# EAGLE design Remote (EAGLE 9.3.2)
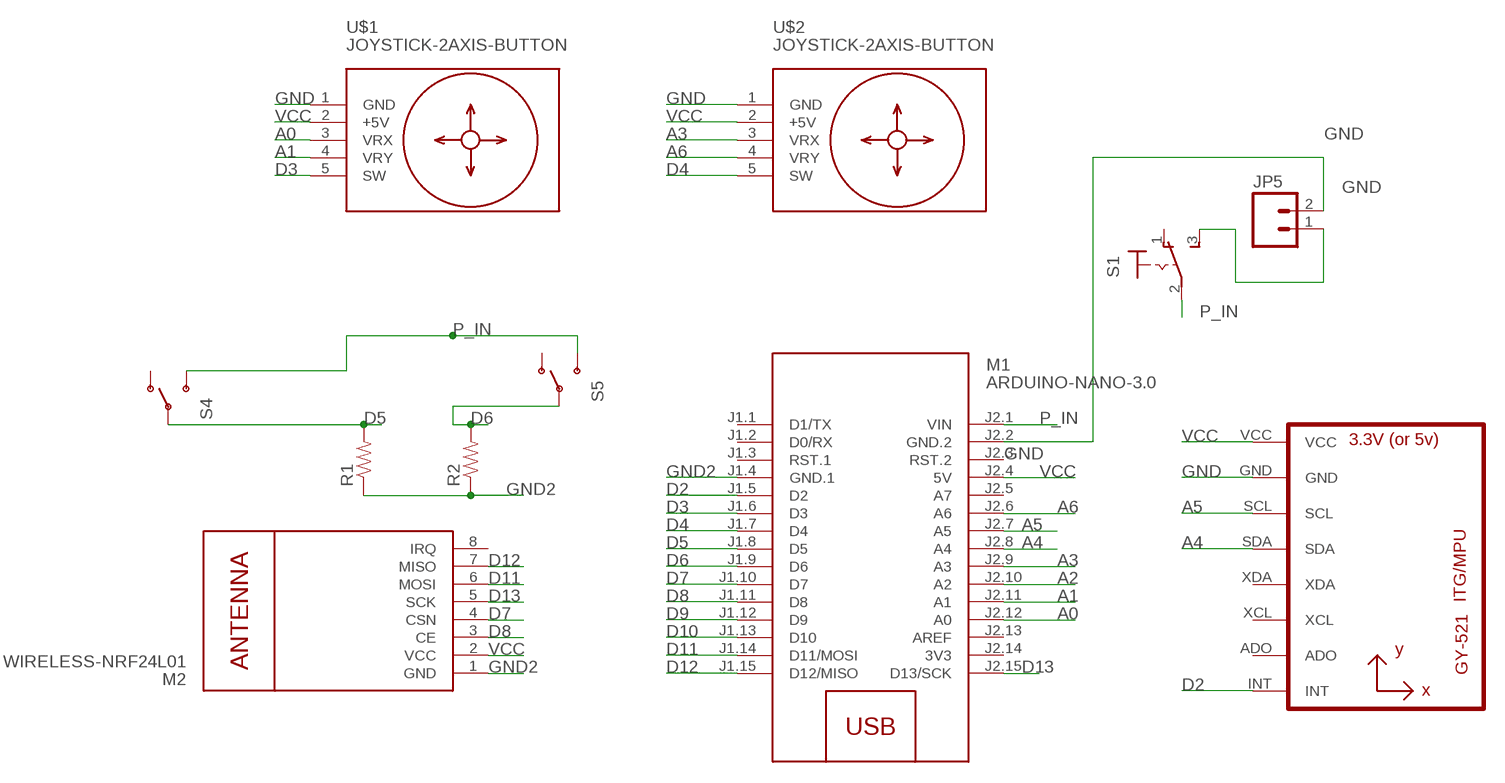
[diagram p0: schematic, sheet 1]

## Parts
JP5  M02PTH  [1X02]
M1  ARDUINO-NANO-3.0  [ARDUINO-NANO-3.0]
M2  WIRELESS-NRF24L01  [WIRELESS-NRF24L01]
R1  RESISTORAXIAL-0.3  [AXIAL-0.3]
R2  RESISTORAXIAL-0.3  [AXIAL-0.3]
S1  M9040P  [M9040P]
S4  SWITCH-SPSTPTH  [SWITCH-SPDT]
S5  SWITCH-SPSTPTH  [SWITCH-SPDT]
U1  GY-521MPU6050  [GY-521]
U$1  JOYSTICK-2AXIS-BUTTON  [JOYSTICK-2AXIS-BUTTON]
U$2  JOYSTICK-2AXIS-BUTTON  [JOYSTICK-2AXIS-BUTTON]

## Nets
A0: M1.J2.12(A0) U$1.3(VRX)
A1: M1.J2.11(A1) U$1.4(VRY)
A2: M1.J2.10(A2)
A3: M1.J2.9(A3) U$2.3(VRX)
A4: M1.J2.8(A4) U1.SDA
A5: M1.J2.7(A5) U1.SCL
A6: M1.J2.6(A6) U$2.4(VRY)
D2: M1.J1.5(D2) U1.INT
D3: M1.J1.6(D3) U$1.5(SW)
D4: M1.J1.7(D4) U$2.5(SW)
D5: M1.J1.8(D5) R1.P$2 S4.2(P)
D6: M1.J1.9(D6) R2.P$2 S5.2(P)
D7: M1.J1.10(D7) M2.4(CSN)
D8: M1.J1.11(D8) M2.3(CE)
D9: M1.J1.12(D9)
D10: M1.J1.13(D10)
D11: M1.J1.14(D11/MOSI) M2.6(MOSI)
D12: M1.J1.15(D12/MISO) M2.7(MISO)
D13: M1.J2.15(D13/SCK) M2.5(SCK)
GND: JP5.2 M1.J2.2(GND.2) U1.GND U$1.1(GND) U$2.1(GND)
GND2: M1.J1.4(GND.1) M2.1(GND) R1.P$1 R2.P$1
N$2: JP5.1 S1.3(S)
P_IN: M1.J2.1(VIN) S1.2(P) S4.3(S) S5.3(S)
VCC: M1.J2.4(5V) M2.2(VCC) U1.VCC U$1.2(+5V) U$2.2(+5V)
Unconnected: M1.J1.1(D1/TX) M1.J1.2(D0/RX) M1.J1.3(RST.1) M1.J2.3(RST.2) M1.J2.5(A7) M1.J2.13(AREF) M2.8(IRQ) S1.1(O) S4.1(O) S5.1(O) U1.ADO U1.XCL U1.XDA

## Power pins joined to a net without a drawn wire
3V3: M1.J2.14(3V3)

## Library data of the parts
JP5 = SparkFun:M02: Header 2 Standard 2-pin 0.1" header. Use with straight break away headers (SKU : PRT-00116), right angle break away headers (PRT-00553), swiss pins (PRT-00743), machine pins (PRT-00117), and female headers (PRT-00115). Molex polarized connector foot print use with SKU : PRT-08233 with associated crimp pins and housings.
M1 = diy-modules:ARDUINO-NANO-3.0: Arduino Nano 3.0 and compatible devices More details available here: https://www.arduino.cc/en/Main/ArduinoBoardNano Click here to find device on ebay.com <http://www.ebay.com/sch/arduino+nano>
M2 = diy-modules:WIRELESS-NRF24L01: 2.4 GHz Wireless Module based on NRF24L01 chip More details available here: http://www.electrodragon.com/w/NRF24L01 Click here to find device on ebay.com <http://www.ebay.com/sch/nrf24l01+arduino>
R1 R2 = SparkFun:RESISTOR: Resistor Basic schematic elements and footprints for 0603, 1206, and PTH resistors.
S1 = switch:M9040P: TOGGLE SWITCH Marquardt
S4 S5 = SparkFun:SWITCH-SPST: SPST Switch Simple slide switch. Spark Fun Electronics SKU : COM-00102
U1 = gy-521:GY-521
U$1 U$2 = diy-modules:JOYSTICK-2AXIS-BUTTON: 2-Axis Analog Joystick with Push Button Tutorial is available here: http://henrysbench.capnfatz.com/henrys-bench/arduino-sensors-and-input/arduino-ps2-joystick-tutorial-keyes-ky-023-deek-robot/ Click here to find device on ebay.com <http://www.ebay.com/sch/joystick+ps2+module>

## Board
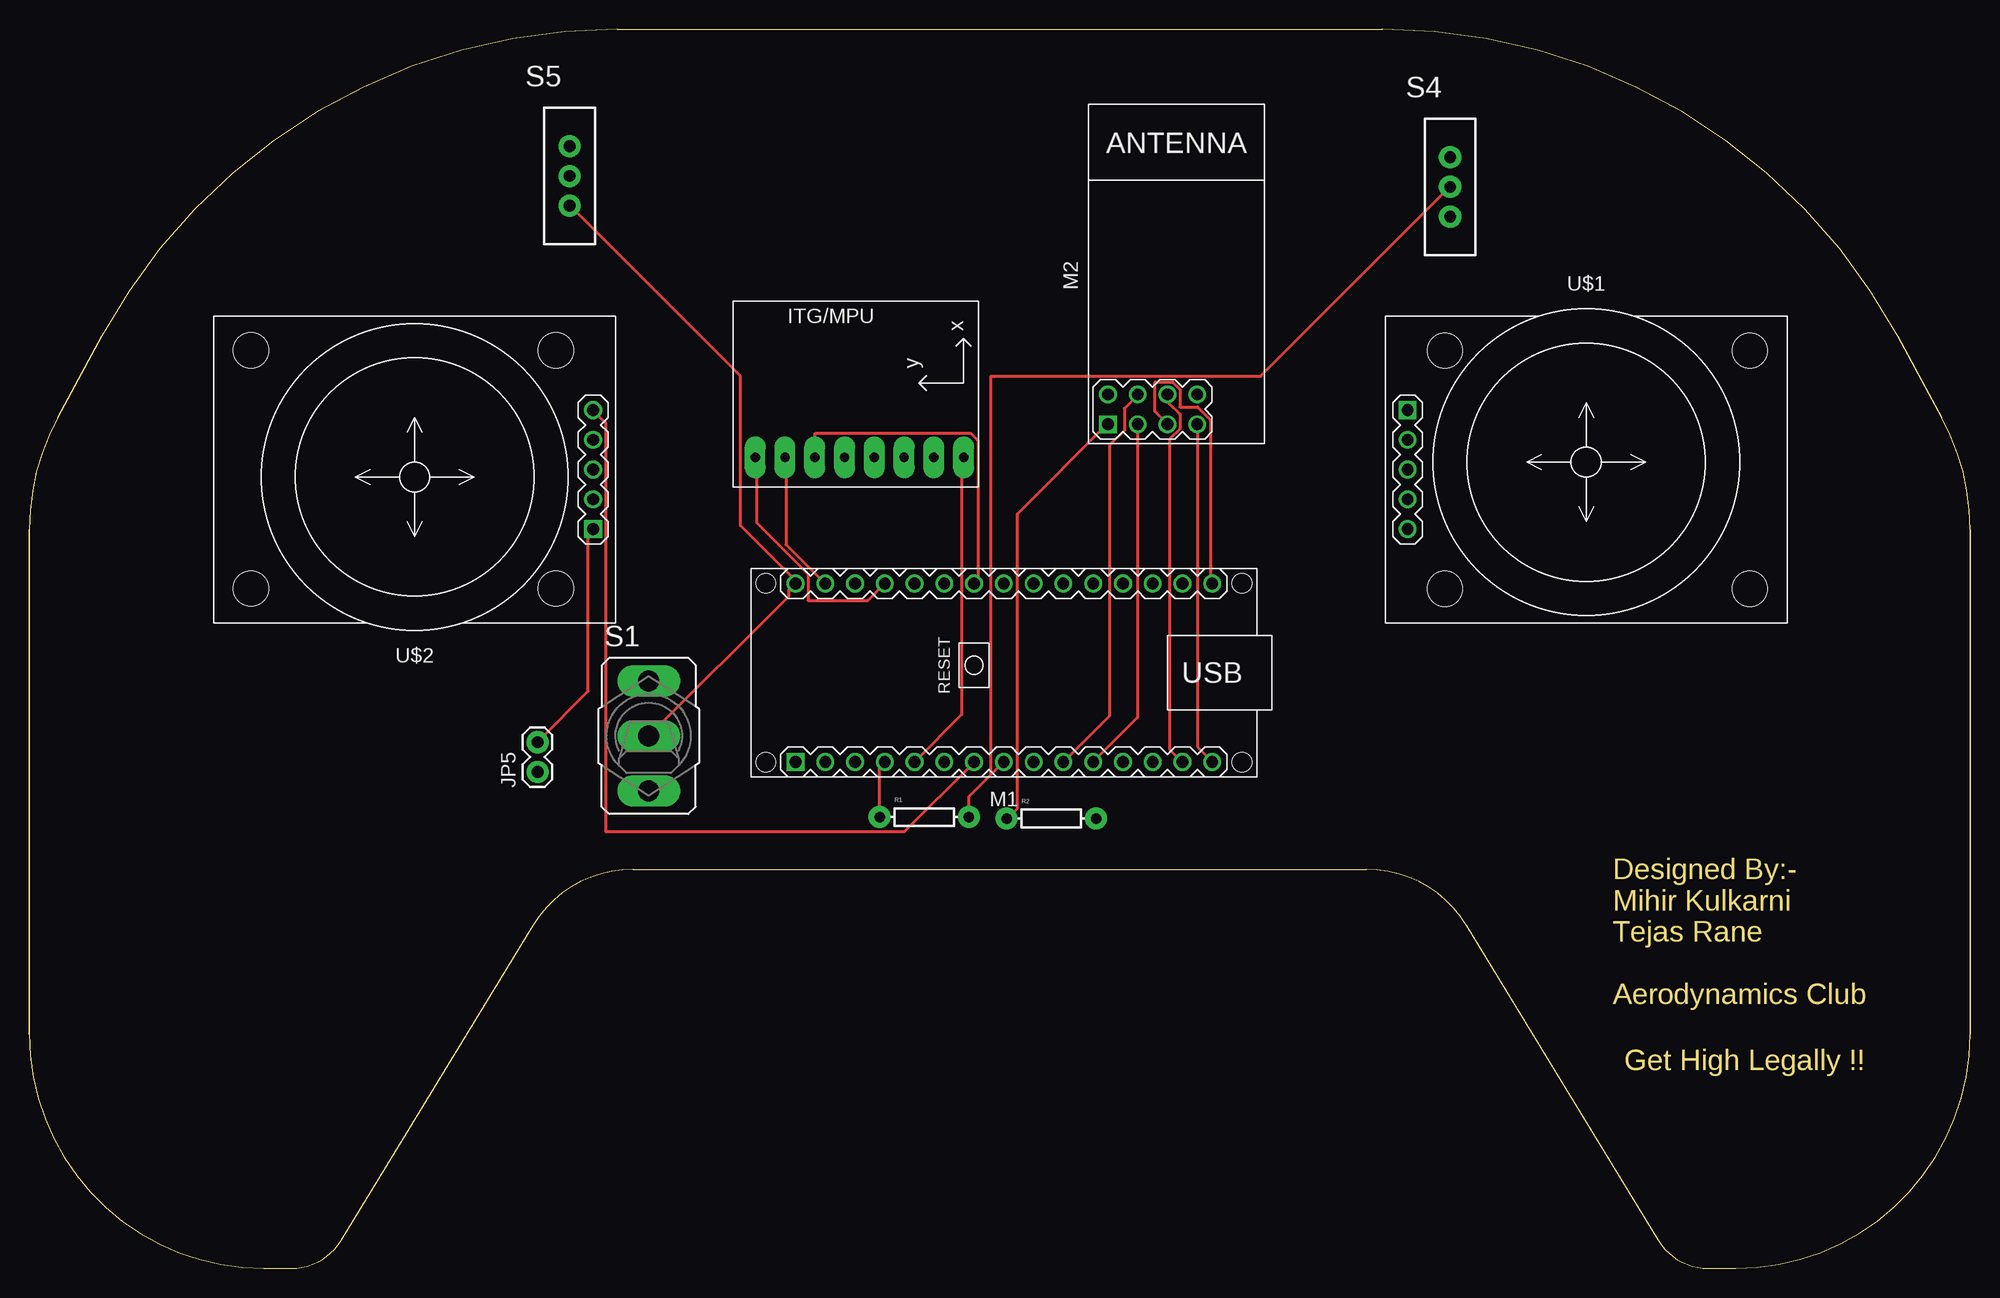
[diagram p1: board, top side]
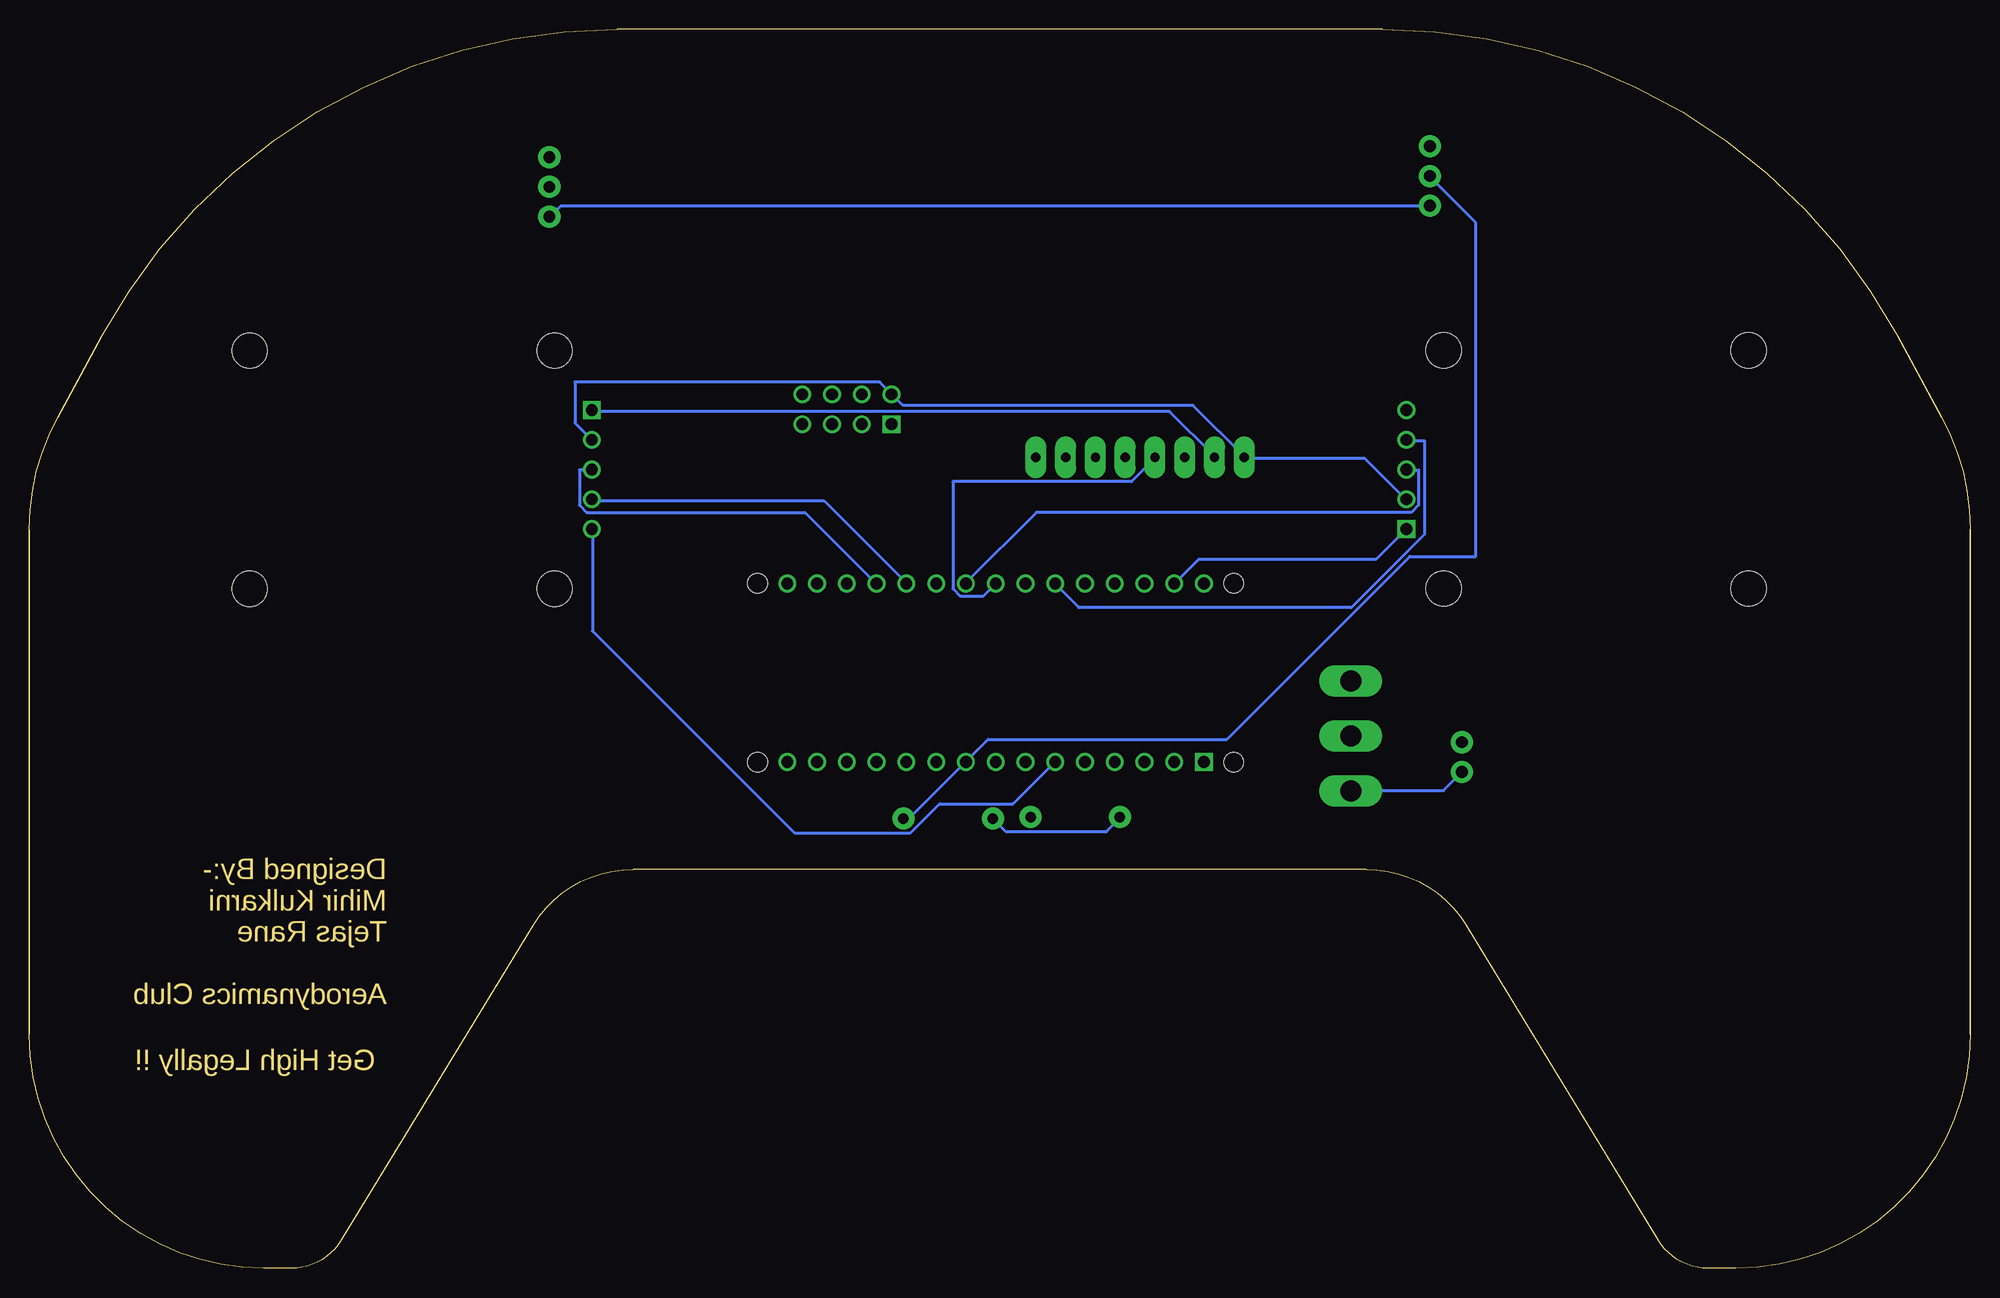
[diagram p2: board, bottom side, seen from below]

Size 165.65 x 105.77 mm. Coordinates in mm from the lower left corner, seen from the top.
Outline: 6.2,79.6 arc-62 50.16,105.77 115.49,105.77 arc-62 159.45,79.6
Outline: 0,20 arc90 20,0 22.34,0 arc59 26.61,2.4
Outline: 165.65,20 arc-90 145.65,0 143.31,0 arc-59 139.04,2.4
Outline: 165.65,63.09 arc28 163.23,72.62
Outline: 2.42,72.62 arc28 0,63.09
Outline: 122.64,29.29 arc59 114.1,34.08 51.55,34.08 arc59 43.01,29.29
Outline: 159.45,79.6 161.57,75.69 163.23,72.62
Outline: 163.23,72.62 159.45,79.6
Outline: 165.65,63.09 165.65,38.96 165.65,20
Outline: 165.65,20 165.65,63.09
Outline: 122.64,29.29 131.82,14.23 139.04,2.4
Outline: 139.04,2.4 122.64,29.29
Outline: 43.01,29.29 33.83,14.23 26.61,2.4
Outline: 26.61,2.4 43.01,29.29
Outline: 0,63.09 0,38.96 0,20
Outline: 0,20 0,63.09
Outline: 2.42,72.62 4.54,76.53 6.2,79.6
Outline: 6.2,79.6 2.42,72.62
Copper layers (1*16): Top 0.035mm / dielectric 1.5mm / Bottom 0.035mm
Design rules "default *": minimum track width 10mil, minimum drill 0.35mm, track to track 6mil, track to pad 6mil, pad to pad 6mil, via to via 6mil, smd to smd 6mil, copper to edge 40mil, drill to drill 6mil, minimum pad ring 10mil, minimum via ring 8mil, stop-mask expansion 4mil, vias tented up to drill 0mil, thermal gap 10mil

### Footprints (pad centres in the part's own frame; a part is rotated, then mirrored left to right if it is on the bottom)
1X02 = drill 1.016 pad 1.88: 1 0,0; 2 2.54,0
ARDUINO-NANO-3.0 = drill 1 square: J1.1 17.78,7.62 | drill 1: J1.2 15.24,7.62; J1.3 12.7,7.62; J1.4 10.16,7.62; J1.5 7.62,7.62; J1.6 5.08,7.62; J1.7 2.54,7.62; J1.8 0,7.62; J1.9 -2.54,7.62; J1.10 -5.08,7.62; J1.11 -7.62,7.62; J1.12 -10.16,7.62; J1.13 -12.7,7.62; J1.14 -15.24,7.62; J1.15 -17.78,7.62; J2.1 17.78,-7.62; J2.2 15.24,-7.62; J2.3 12.7,-7.62; J2.4 10.16,-7.62; J2.5 7.62,-7.62; J2.6 5.08,-7.62; J2.7 2.54,-7.62; J2.8 0,-7.62; J2.9 -2.54,-7.62; J2.10 -5.08,-7.62; J2.11 -7.62,-7.62; J2.12 -10.16,-7.62; J2.13 -12.7,-7.62; J2.14 -15.24,-7.62; J2.15 -17.78,-7.62 | hole 1.651: -20.32,7.62; -20.32,-7.62; 20.32,-7.62; 20.32,7.62
WIRELESS-NRF24L01 = drill 1 square: 1 -12.7,6.35 | drill 1: 2 -10.16,6.35; 3 -12.7,3.81; 4 -10.16,3.81; 5 -12.7,1.27; 6 -10.16,1.27; 7 -12.7,-1.27; 8 -10.16,-1.27
AXIAL-0.3 = drill 0.9 pad 1.88: P$1 -3.81,0; P$2 3.81,0
M9040P = drill 1.803 long: 1 0,4.699; 2 0,0; 3 0,-4.699
SWITCH-SPDT = drill 1.016 pad 1.88: 1 0,2.54; 2 0,0; 3 0,-2.54
GY-521 = drill 0.8 pad 1.778 long: ADO -8.89,-6.35; GND -8.89,6.35; INT -8.89,-8.89; SCL -8.89,3.81; SDA -8.89,1.27; VCC -8.89,8.89; XCL -8.89,-3.81; XDA -8.89,-1.27
JOYSTICK-2AXIS-BUTTON = drill 1 square: 1 -15.24,5.08 | drill 1: 2 -15.24,2.54; 3 -15.24,0; 4 -15.24,-2.54; 5 -15.24,-5.08 | hole 3: -12.065,10.16; -12.065,-10.16; 13.97,-10.16; 13.97,10.16

### Placement (x,y rotation side)
JP5  43.37,42.38 90 top
M1  83.17,50.85 180 top
M2  98.41,84.76 90 top
R1  76.38,38.52 0 top
R2  87.23,38.4 0 top
S1  52.86,45.46 0 top
S4  121.26,92.32 0 top
S5  46.12,93.25 0 top
U1  70.85,78.11 90 top
U$1  132.88,68.19 0 top
U$2  32.88,68.19 180 top

### Tracks (layer width: path | path; a pad name or v marks a point on that pad's centre or on a via)
A0
  Bottom 0.254: M1.J2.12 93.45,58.53 99.45,64.53 118.07,64.53 118.7,65.16 118.7,68.16 117.7,68.16 U$1.3
A1
  Bottom 0.254: M1.J2.11 90.82,58.53 97.82,65.53 117.57,65.53 U$1.4
A3
  Bottom 0.254: M1.J2.9 85.7,58.53 79.7,64.53 47.7,64.53 47.07,65.16 47.07,68.16 48.07,68.16 U$2.3
A4
  Bottom 0.254: M1.J2.8 83.2,58.41 84.2,57.41 86.2,57.41 86.82,58.03 86.82,67.16 71.57,67.16 69.57,69.16 U1.SDA
A5
  Top 0.254: M1.J2.7 80.7,58.53 80.95,58.78 80.95,70.66 80.32,71.28 67.07,71.28 67.07,69.28 U1.SCL
A6
  Bottom 0.254: M1.J2.6 78.07,58.41 76.07,56.41 52.82,56.41 46.57,62.66 46.57,70.66 48.07,70.66 U$2.4
D2
  Top 0.254: M1.J1.5 75.57,43.28 79.57,47.28 79.57,69.03 79.7,69.16 U1.INT
D3
  Bottom 0.254: M1.J1.6 78.2,43.16 81.7,39.66 87.95,39.66 90.45,37.16 100.32,37.16 117.57,54.41 117.57,63.03 U$1.5
D4
  Top 0.254: M1.J1.7 80.57,43.16 74.7,37.28 49.2,37.28 49.2,72.16 48.2,73.16 U$2.5
D5
  Top 0.254: 82.14,42.22 80.2,40.28 80.2,38.53 R1.P$2 | 82.14,42.22 83.07,43.16 M1.J1.8 | S4.2 121.2,92.28 105.07,76.16 82.07,76.16 82.07,42.28 82.14,42.22
D6
  Bottom 0.254: R2.P$2 90.95,38.41 90.57,38.41 85.82,43.16 M1.J1.9 85.7,43.28 83.82,45.16 63.45,45.16 47.82,60.78 42.2,60.78 42.2,89.28 46.07,93.16 S5.2
D7
  Top 0.254: M1.J1.10 88.32,43.28 92.2,47.16 92.2,70.28 93.45,71.53 93.45,73.41 94.57,74.53 M2.4
D8
  Top 0.254: M1.J1.11 90.82,43.28 94.57,47.03 94.57,72.03 M2.3
D11
  Top 0.254: M1.J1.14 98.32,43.28 97.32,44.28 97.32,70.78 98.2,71.66 98.2,72.91 97.2,73.91 97.2,74.53 M2.6
D12
  Top 0.254: M1.J1.15 100.95,43.28 99.7,44.53 99.7,72.03 M2.7
D13
  Top 0.254: M1.J2.15 100.95,58.53 100.82,58.66 100.82,72.41 99.7,73.53 98.2,73.53 98.2,75.03 97.57,75.66 96.07,75.66 96.07,73.16 97.07,72.16 M2.5
GND
  Top 0.254: U$2.1 48.07,63.03 47.7,62.66 47.7,49.28 43.45,45.03 JP5.2 | M1.J2.2 67.82,58.53 64.57,61.78 64.57,69.16 U1.GND
  Bottom 0.254: U$1.1 117.57,73.16 68.32,73.16 64.45,69.28 U1.GND | U$2.1 48.2,63.03 50.7,60.53 65.82,60.53 67.82,58.53 M1.J2.2
GND2
  Top 0.254: M1.J1.4 72.95,43.16 72.57,42.78 72.57,38.53 R1.P$1 | M2.1 91.95,72.03 84.32,64.41 84.32,39.28 83.45,38.41 R2.P$1
  Bottom 0.254: R1.P$1 72.57,38.41 73.7,37.28 82.32,37.28 83.32,38.28 R2.P$1
N$2
  Bottom 0.254: JP5.1 43.45,42.28 44.95,40.78 52.82,40.78 S1.3
P_IN
  Top 0.254: S1.2 52.95,45.53 64.82,57.41 64.82,57.91 65.32,58.41 M1.J2.1 65.32,58.53 65.32,58.78 60.7,63.41 60.7,76.16 46.2,90.66 S5.3
  Bottom 0.254: S4.3 121.2,89.78 120.32,90.66 46.2,90.66 S5.3
VCC
  Top 0.254: M1.J2.4 72.95,58.41 71.57,57.03 66.45,57.03 66.45,59.28 62.07,63.66 62.07,69.16 U1.VCC
  Bottom 0.254: U$2.2 48.2,65.66 51.7,69.16 61.95,69.16 U1.VCC 61.95,69.28 66.32,73.66 91.07,73.66 91.95,74.53 M2.2 92.07,74.66 93.07,75.66 119.07,75.66 119.07,72.16 117.7,70.78 U$1.2

### Text on the board
Dimension: Designed By:- / Mihir Kulkarni / Tejas Rane / / Aerodynamics Club | Get High Legally !!